# EAGLE design HID2AMI.Deluxe.Rev2.0.0 (EAGLE 9.6.2)
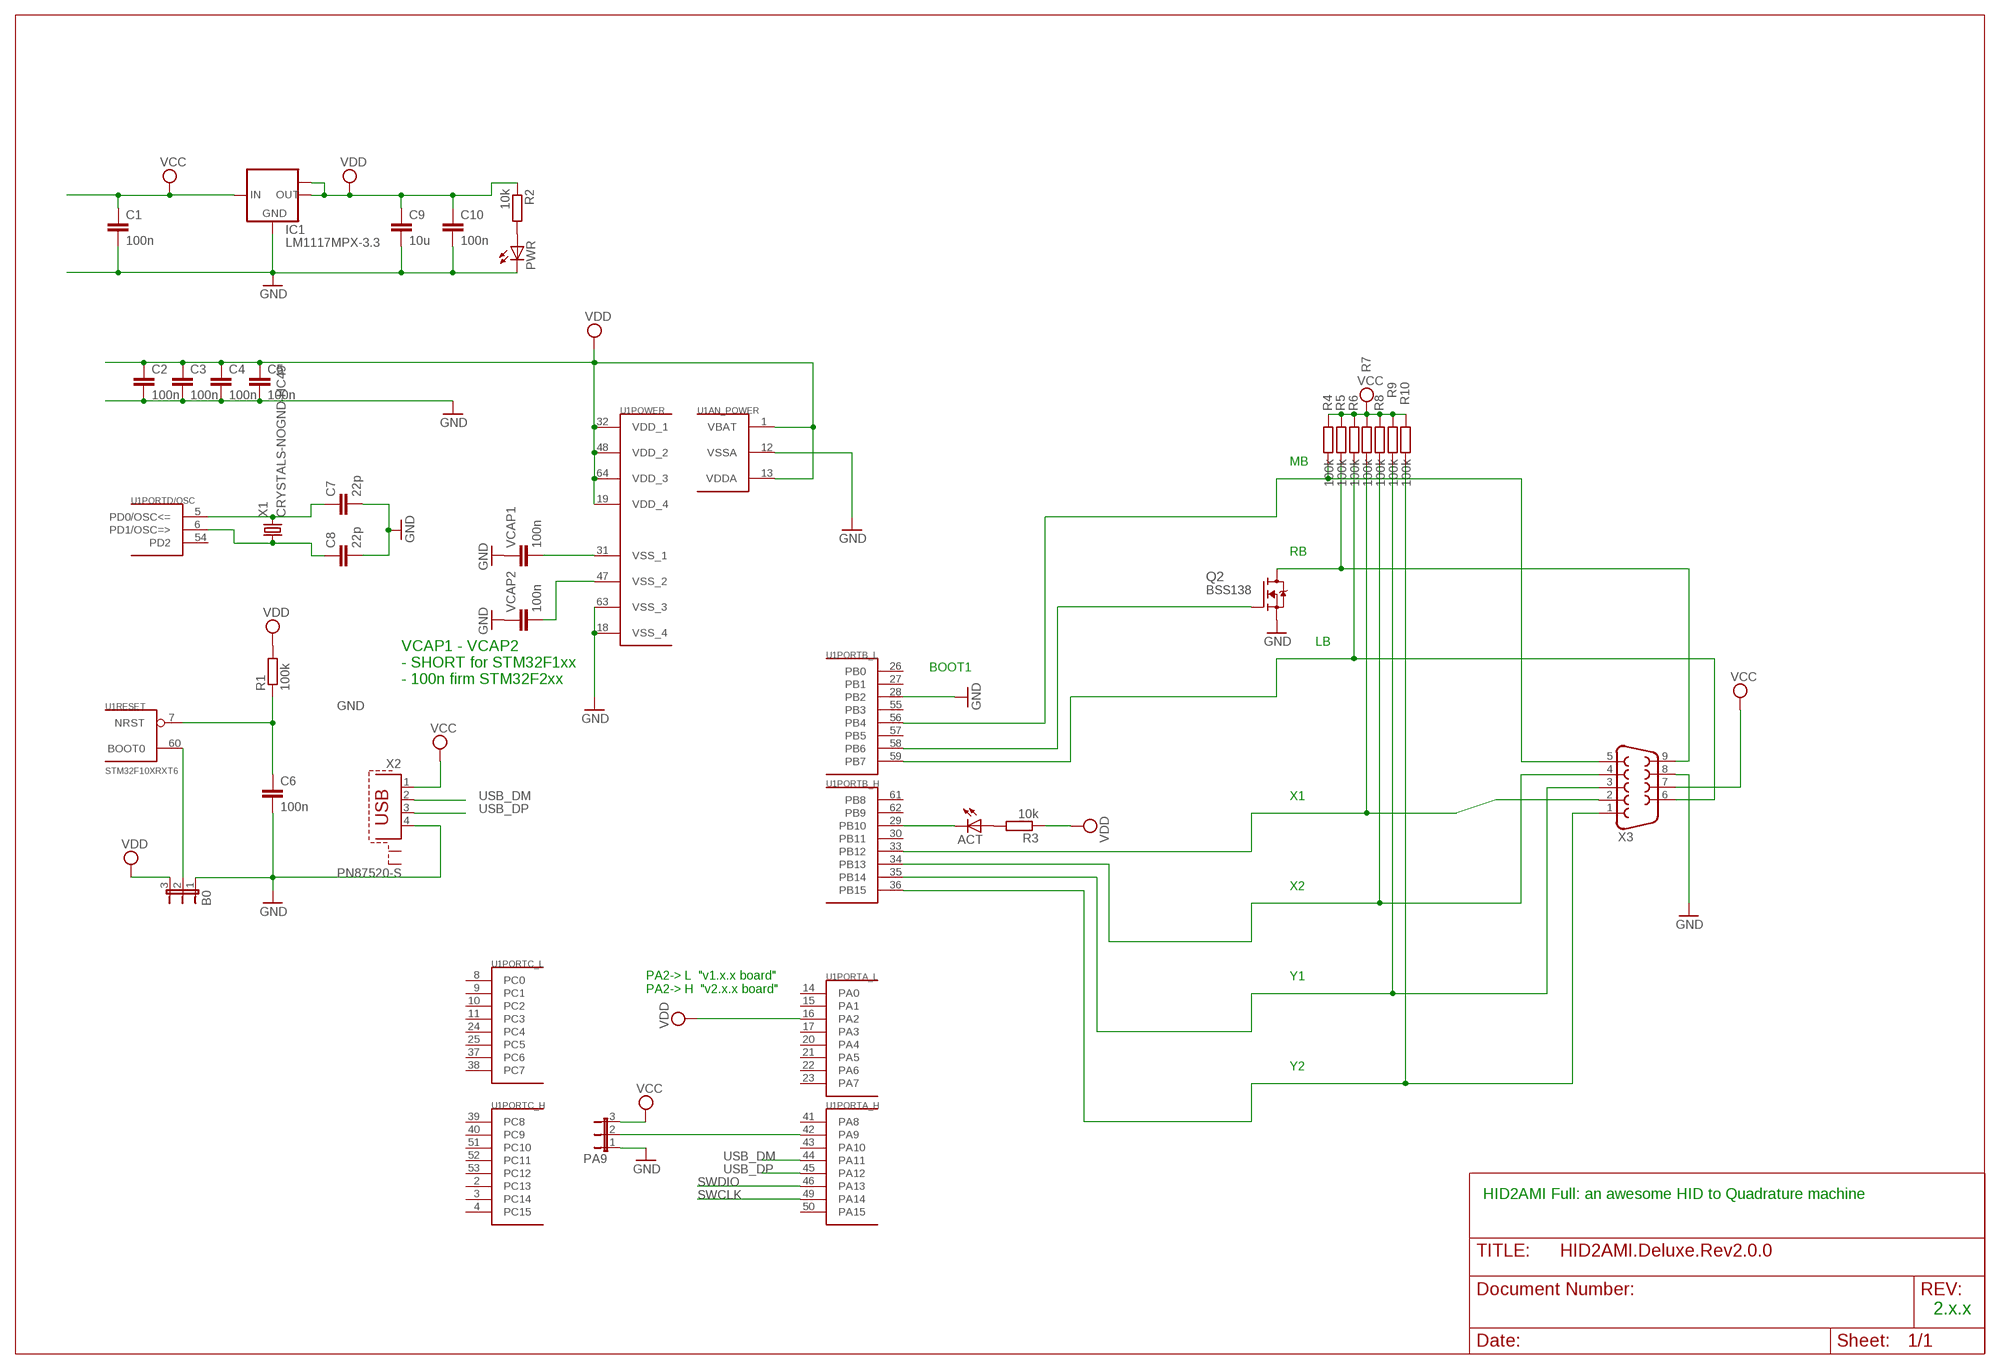
[diagram p0: schematic, sheet 1]

## Parts
ACT  LEDSML0805  [SML0805]
B0  JP2E  [JP2]
C1  100n  C-EUC0805  [C0805]
C2  100n  C-EUC0805  [C0805]
C3  100n  C-EUC0805  [C0805]
C4  100n  C-EUC0805  [C0805]
C5  100n  C-EUC0805  [C0805]
C6  100n  C-EUC0805  [C0805]
C7  22p  C-EUC0805  [C0805]
C8  22p  C-EUC0805  [C0805]
C9  10u  C-EUC0805  [C0805]
C10  100n  C-EUC0805  [C0805]
IC1  LM1117MPX-3.3  [SOT223]
PA9  JP2E  [JP2]
PWR  LEDSML0805  [SML0805]
Q2  BSS138  [SOT23]
R1  100k  R-EU_M0805  [M0805]
R2  10k  R-EU_M0805  [M0805]
R3  10k  R-EU_M0805  [M0805]
R4  100k  R-EU_M0805  [M0805]
R5  100k  R-EU_M0805  [M0805]
R6  100k  R-EU_M0805  [M0805]
R7  100k  R-EU_M0805  [M0805]
R8  100k  R-EU_M0805  [M0805]
R9  100k  R-EU_M0805  [M0805]
R10  100k  R-EU_M0805  [M0805]
U1  STM32F10XRXT6  [TQFP64]
VCAP1  100n  C-EUC0805  [C0805]
VCAP2  100n  C-EUC0805  [C0805]
X1  CRYSTALS-NOGND-HC49  [HC49]
X2  PN87520-S  [PN87520-S]
X3  F09HP  [F09HP]

## Nets
ACT: R7.2 U1.33(PORTB_H:PB12) X3.2
GND: B0.1 C1.2 C2.2 C3.2 C4.2 C5.2 C6.2 C7.2 C8.2 C9.2 C10.2 IC1.1(GND) PA9.1 PWR.C Q2.2(S) U1.12(AN_POWER:VSSA) U1.18(POWER:VSS_4) U1.28(PORTB_L:PB2) U1.63(POWER:VSS_3) VCAP1.1 VCAP2.1 X2.4 X3.8
N$1: C7.1 U1.5(PORTD/OSC:PD0/OSC<=) X1.2
N$2: C8.1 U1.6(PORTD/OSC:PD1/OSC=>) X1.1
N$3: B0.2 U1.60(RESET:BOOT0)
N$4: U1.31(POWER:VSS_1) VCAP1.2
N$5: PA9.2 U1.42(PORTA_H:PA9)
N$6: U1.47(POWER:VSS_2) VCAP2.2
N$7: ACT.A R3.2
N$8: ACT.C U1.29(PORTB_H:PB10)
N$12: PWR.A R2.2
N$13: R4.2 U1.56(PORTB_L:PB4) X3.5
N$14: Q2.1(G) U1.58(PORTB_L:PB6)
N$15: R6.2 U1.59(PORTB_L:PB7) X3.6
N$35: Q2.3(D) R5.2 X3.9
N$38: R8.2 U1.34(PORTB_H:PB13) X3.4
N$39: R9.2 U1.35(PORTB_H:PB14) X3.3
N$40: R10.2 U1.36(PORTB_H:PB15) X3.1
NRST: C6.1 R1.1 U1.7(RESET:NRST)
SWCLK: U1.49(PORTA_H:PA14)
SWDIO: U1.46(PORTA_H:PA13)
USB_DM: U1.44(PORTA_H:PA11) X2.2
USB_DP: U1.45(PORTA_H:PA12) X2.3
VCC: C1.1 IC1.3(IN) PA9.3 R4.1 R5.1 R6.1 R7.1 R8.1 R9.1 R10.1 X2.1 X3.7
VDD: B0.3 C2.1 C3.1 C4.1 C5.1 C9.1 C10.1 IC1.2(OUT) IC1.TAB(OUT1) R1.2 R2.1 R3.1 U1.1(AN_POWER:VBAT) U1.13(AN_POWER:VDDA) U1.16(PORTA_L:PA2) U1.19(POWER:VDD_4) U1.32(POWER:VDD_1) U1.48(POWER:VDD_2) U1.64(POWER:VDD_3)
Unconnected: U1.2(PORTC_H:PC13) U1.3(PORTC_H:PC14) U1.4(PORTC_H:PC15) U1.8(PORTC_L:PC0) U1.9(PORTC_L:PC1) U1.10(PORTC_L:PC2) U1.11(PORTC_L:PC3) U1.14(PORTA_L:PA0) U1.15(PORTA_L:PA1) U1.17(PORTA_L:PA3) U1.20(PORTA_L:PA4) U1.21(PORTA_L:PA5) U1.22(PORTA_L:PA6) U1.23(PORTA_L:PA7) U1.24(PORTC_L:PC4) U1.25(PORTC_L:PC5) U1.26(PORTB_L:PB0) U1.27(PORTB_L:PB1) U1.30(PORTB_H:PB11) U1.37(PORTC_L:PC6) U1.38(PORTC_L:PC7) U1.39(PORTC_H:PC8) U1.40(PORTC_H:PC9) U1.41(PORTA_H:PA8) U1.43(PORTA_H:PA10) U1.50(PORTA_H:PA15) U1.51(PORTC_H:PC10) U1.52(PORTC_H:PC11) U1.53(PORTC_H:PC12) U1.54(PORTD/OSC:PD2) U1.55(PORTB_L:PB3) U1.57(PORTB_L:PB5) U1.61(PORTB_H:PB8) U1.62(PORTB_H:PB9) X2.S1 X2.S2

## Notes on the sheet
- MB
- RB
- LB
- BOOT1
- VCAP1 - VCAP2
  - SHORT for STM32F1xx
  - 100n firm STM32F2xx
- X1
- X2
- Y1
- PA2-> L  "v1.x.x board"
  PA2-> H  "v2.x.x board"
- Y2
- HID2AMI Full: an awesome HID to Quadrature machine
- 2.x.x

## Library data of the parts
ACT PWR = led:LED: LED OSRAM: - CHIPLED LG R971, LG N971, LY N971, LG Q971, LY Q971, LO R971, LY R971 LH N974, LH R974 LS Q976, LO Q976, LY Q976 LO Q996 - Hyper CHIPLED LW Q18S LB Q993, LB Q99A, LB R99A - SideLED LS A670, LO A670, LY A670, LG A670, LP A670 LB A673, LV A673, LT A673, LW A673 LH A674 LY A675 LS A676, LA A676, LO A676, LY A676, LW A676 LS A679, LY A679, LG A679 - Hyper Micro SIDELED® LS Y876, LA Y876, LO Y876, LY Y876 LT Y87S - SmartLED LW L88C, LW L88S LB L89C, LB L89S, LG L890 LS L89K, LO L89K, LY L89K LS L896, LA L896, LO L896, LY L896 - TOPLED LS T670, LO T670, LY T670, LG T670, LP T670 LSG T670, LSP T670, LSY T670, LOP T670, LYG T670 LG T671, LOG T671, LSG T671 LB T673, LV T673, LT T673, LW T673 LH T674 LS T676, LA T676, LO T676, LY T676, LB T676, LH T676, LSB T676, LW T676 LB T67C, LV T67C, LT T67C, LS T67K, LO T67K, LY T67K, LW E67C LS E67B, LA E67B, LO E67B, LY E67B, LB E67C, LV E67C, LT E67C LW T67C LS T679, LY T679, LG T679 LS T770, LO T770, LY T770, LG T770, LP T770 LB T773, LV T773, LT T773, LW T773 LH T774 LS E675, LA E675, LY E675, LS T675 LS T776, LA T776, LO T776, LY T776, LB T776 LHGB T686 LT T68C, LB T68C - Hyper Mini TOPLED® LB M676 - Mini TOPLED Santana® LG M470 LS M47K, LO M47K, LY M47K Source: http://www.osram.convergy.de LUXEON: - LUMILED® LXK2-PW12-R00, LXK2-PW12-S00, LXK2-PW14-U00, LXK2-PW14-V00 LXK2-PM12-R00, LXK2-PM12-S00, LXK2-PM14-U00 LXK2-PE12-Q00, LXK2-PE12-R00, LXK2-PE12-S00, LXK2-PE14-T00, LXK2-PE14-U00 LXK2-PB12-K00, LXK2-PB12-L00, LXK2-PB12-M00, LXK2-PB14-N00, LXK2-PB14-P00, LXK2-PB14-Q00 LXK2-PR12-L00, LXK2-PR12-M00, LXK2-PR14-Q00, LXK2-PR14-R00 LXK2-PD12-Q00, LXK2-PD12-R00, LXK2-PD12-S00 LXK2-PH12-R00, LXK2-PH12-S00 LXK2-PL12-P00, LXK2-PL12-Q00, LXK2-PL12-R00 Source: www.luxeon.com KINGBRIGHT: KA-3528ASYC Source: www.kingbright.com
B0 PA9 = jumper:JP2E: JUMPER
C1-C10 VCAP1 VCAP2 = rcl:C-EU: CAPACITOR, European symbol; SPICEPREFIX: C
IC1 = lm1117:LM1117MPX-*
Q2 = bss138_10:BSS138: BSS138 N-Channel Logic Level Enhancement Mode Field Effect Transistor Source: http://www.fairchildsemi.com/datasheets/BS/BSS138.pdf; MF: Fairchild; MPN: BSS138; OC_FARNELL: 9845330; OC_NEWARK: 67R2009
R1-R10 = rcl:R-EU_: RESISTOR, European symbol; SPICEPREFIX: R
U1 = stm32:STM32F10XRXT6: STM32F101/103 64pin LQFP
X1 = IQD-Frequency-Products:CRYSTALS-NOGND: CRYSTALS CAN NOT GROUNDED
X2 = con-berg:PN87520-S; OC_FARNELL: unknown; OC_NEWARK: unknown
X3 = con-subd:F09: SUB-D; OC_FARNELL: unknown; OC_NEWARK: unknown

## Board
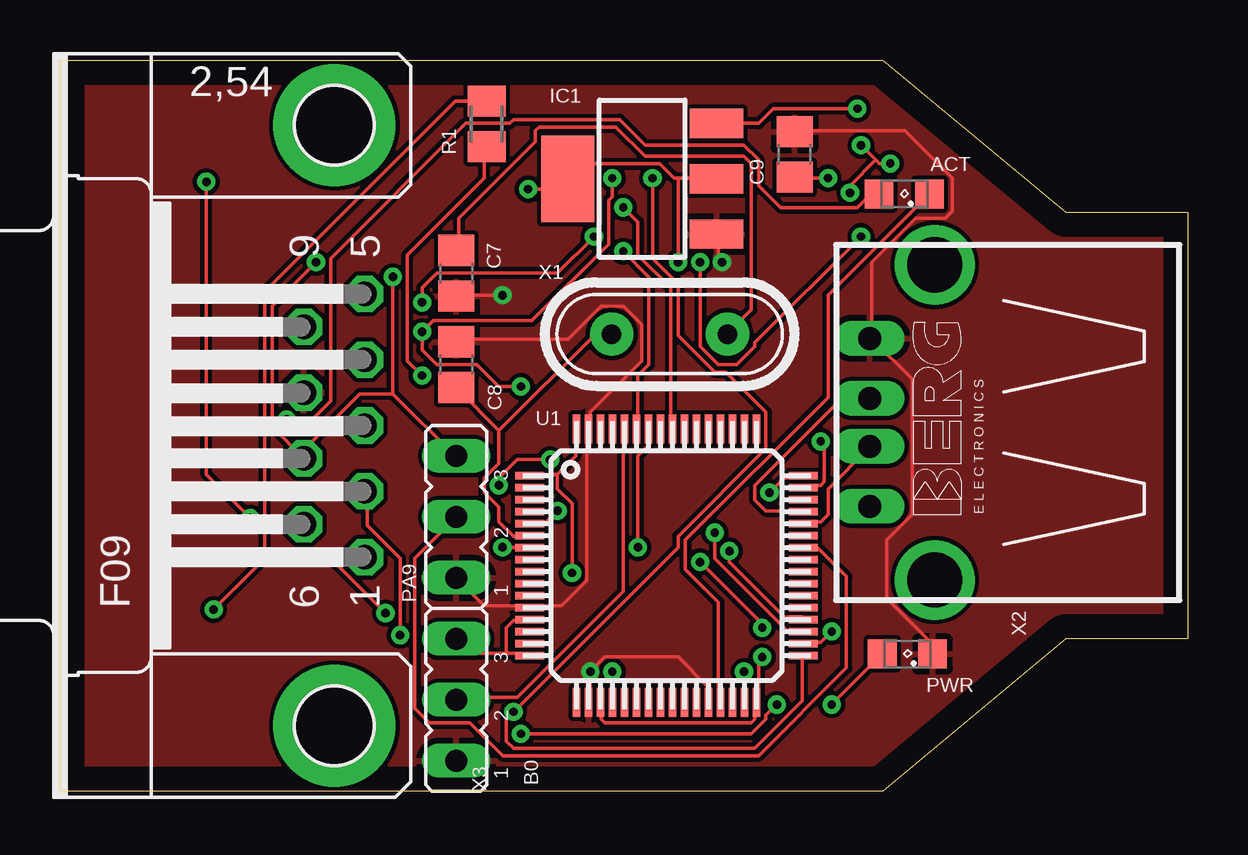
[diagram p1: board, top side]
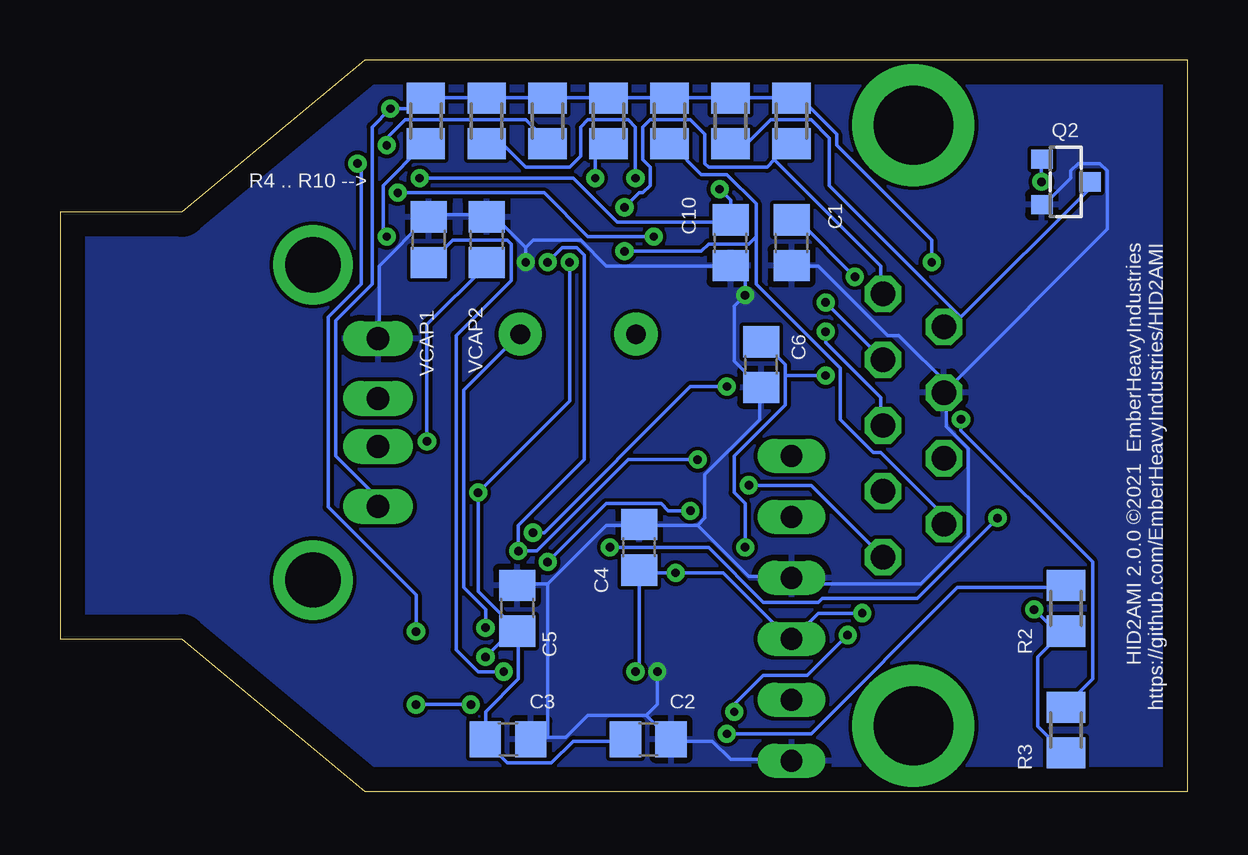
[diagram p2: board, bottom side, seen from below]

Size 46.99 x 30.48 mm. Coordinates in mm from the lower left corner, seen from the top.
Outline: 0,30.48 34.29,30.48 41.91,24.13 46.99,24.13 46.99,6.35 41.91,6.35 34.29,0 0,0 0,30.48
Copper layers (1*16): Top 0.035mm / dielectric 1.5mm / Bottom 0.035mm
Design rules "default *": minimum track width 6mil, minimum drill 0.35mm, track to track 6mil, track to pad 6mil, pad to pad 6mil, via to via 6mil, smd to smd 6mil, copper to edge 40mil, drill to drill 6mil, minimum pad ring 10mil, minimum via ring 8mil, stop-mask expansion 4mil, vias tented up to drill 0mil, thermal gap 10mil

### Footprints (pad centres in the part's own frame; a part is rotated, then mirrored left to right if it is on the bottom)
SML0805 = smd 1.2 x 1.2: A 1.05,0; C -1.05,0
JP2 = drill 0.914 long: 1 -2.54,0; 2 0,0; 3 2.54,0
C0805 = smd 1.3 x 1.5: 1 -0.95,0; 2 0.95,0
SOT223 = smd 1.219 x 2.235: 1 -2.311,-3.099; 2 0,-3.099; 3 2.311,-3.099 | smd 3.6 x 2.2: TAB 0,3.099
SOT23 = smd 0.8 x 0.9: 1 -0.95,-1; 2 0.95,-1; 3 0,1
M0805 = smd 1.3 x 1.6: 1 -0.95,0; 2 0.95,0
TQFP64 = smd 1.2 x 0.3: 1 -5.7,3.75; 2 -5.7,3.25; 3 -5.7,2.75; 4 -5.7,2.25; 5 -5.7,1.75; 6 -5.7,1.25; 7 -5.7,0.75; 8 -5.7,0.25; 9 -5.7,-0.25; 10 -5.7,-0.75; 11 -5.7,-1.25; 12 -5.7,-1.75; 13 -5.7,-2.25; 14 -5.7,-2.75; 15 -5.7,-3.25; 16 -5.7,-3.75; 33 5.7,-3.75; 34 5.7,-3.25; 35 5.7,-2.75; 36 5.7,-2.25; 37 5.7,-1.75; 38 5.7,-1.25; 39 5.7,-0.75; 40 5.7,-0.25; 41 5.7,0.25; 42 5.7,0.75; 43 5.7,1.25; 44 5.7,1.75; 45 5.7,2.25; 46 5.7,2.75; 47 5.7,3.25; 48 5.7,3.75 | smd 0.3 x 1.2: 17 -3.75,-5.7; 18 -3.25,-5.7; 19 -2.75,-5.7; 20 -2.25,-5.7; 21 -1.75,-5.7; 22 -1.25,-5.7; 23 -0.75,-5.7; 24 -0.25,-5.7; 25 0.25,-5.7; 26 0.75,-5.7; 27 1.25,-5.7; 28 1.75,-5.7; 29 2.25,-5.7; 30 2.75,-5.7; 31 3.25,-5.7; 32 3.75,-5.7; 49 3.75,5.7; 50 3.25,5.7; 51 2.75,5.7; 52 2.25,5.7; 53 1.75,5.7; 54 1.25,5.7; 55 0.75,5.7; 56 0.25,5.7; 57 -0.25,5.7; 58 -0.75,5.7; 59 -1.25,5.7; 60 -1.75,5.7; 61 -2.25,5.7; 62 -2.75,5.7; 63 -3.25,5.7; 64 -3.75,5.7
HC49 = drill 0.813 pad 1.8: 1 -2.413,0; 2 2.413,0
PN87520-S = drill 0.95 long: 1 -3.5,2.71; 2 -1,2.71; 3 1,2.71; 4 3.5,2.71 | drill 2.3 pad 2.9: S1 -6.57,0; S2 6.57,0
F09HP = drill 1.016 octagon: 1 -5.486,-1.27; 2 -2.743,-1.27; 3 0,-1.27; 4 2.743,-1.27; 5 5.486,-1.27; 6 -4.115,1.27; 7 -1.372,1.27; 8 1.372,1.27; 9 4.115,1.27 | drill 3.302 pad 5.08: G1 -12.522,0; G2 12.522,0

### Placement (x,y rotation side)
ACT  35.18,24.89 180 top
B0  16.51,3.81 90 top
C1  16.51,22.86 270 bottom
C2  22.48,2.16 0 bottom
C3  28.32,2.16 0 bottom
C4  22.86,10.16 90 bottom
C5  27.94,7.62 90 bottom
C6  17.78,17.78 270 bottom
C7  16.51,21.59 270 top
C8  16.51,17.78 90 top
C9  30.61,26.54 90 top
C10  19.05,22.86 270 bottom
IC1  24.26,25.53 90 top
PA9  16.51,11.43 90 top
PWR  35.31,5.71 180 top
Q2  5.08,25.4 270 bottom
R1  17.78,27.81 90 top
R2  5.08,7.62 90 bottom
R3  5.08,2.54 90 bottom
R4  16.51,27.94 270 bottom
R5  19.05,27.94 270 bottom
R6  21.59,27.94 270 bottom
R7  24.13,27.94 270 bottom
R8  26.67,27.94 270 bottom
R9  29.21,27.94 270 bottom
R10  31.75,27.94 270 bottom
U1  25.27,9.4 0 top
VCAP1  31.62,22.99 270 bottom
VCAP2  29.21,22.99 270 bottom
X1  25.4,19.05 0 top
X2  36.45,15.37 90 top
X3  11.43,15.24 90 top

### Tracks (layer width: path | path; a pad name or v marks a point on that pad's centre or on a via)
ACT  (via drill 0.35)
  Top 0.152: v24.69,25.55 24.69,22.2 25.76,21.13 25.76,19 27.28,17.48 27.74,17.48 29.41,15.8 29.41,14.28 25.76,10.62 25.76,10.16 v18.9,3.3 18.59,3 18.59,2.08 18.9,1.78 28.96,1.78 30.94,3.76 30.94,5.59 U1.33 | v14.17,6.5 14.17,9.7 12.8,11.07 12.8,12.45 X3.2
  Bottom 0.152: v24.69,25.55 24.69,26.47 24.23,26.92 R7.2 | v14.17,6.5 15.85,4.83 17.68,4.83 18.9,3.61 v18.9,3.3
GND  (via drill 0.35)
  Top 0.152: v18.44,20.68 16.61,20.68 C7.2 | v27.58,22.05 27.43,22.2 27.43,23.11 IC1.1 | PWR.C 36.27,5.74 36.27,6.2 34.44,8.03 34.44,10.46 35.51,11.53 35.51,17.17 33.83,18.85 X2.4 33.83,19 33.83,22.05 35.66,23.88 36.88,23.88 37.19,24.18 37.19,25.55 35.2,27.53 30.63,27.53 C9.2 | PA9.1 17.68,7.72 19.51,7.72 U1.12 19.66,7.72 20.88,7.72 21.95,8.79 21.95,15.04 U1.63 22.1,15.19 22.1,15.8 24.23,17.93 24.23,19.46 23.47,20.22 22.55,20.22 21.18,18.85 16.61,18.85 C8.2 | U1.18 22.1,3.76 v22.1,4.98 22.71,5.59 25.76,5.59 26.98,4.37 26.98,3.76 U1.28
  Bottom 0.152: 19.05,21.89 18.44,21.29 v18.44,20.68 18.9,20.22 18.9,17.93 17.83,16.87 C6.2 17.83,16.71 17.83,15.49 20.12,13.21 20.12,11.38 20.42,11.07 | 27.58,22.66 v27.58,22.05 | 27.58,22.66 28.8,23.88 29.11,23.88 VCAP2.1 29.26,24.03 31.55,24.03 VCAP1.1 31.7,23.88 33.68,21.89 33.68,19 X2.4 | 19.05,21.89 24.23,21.89 25.3,22.96 27.28,22.96 27.58,22.66 | 19.05,21.89 C10.2 | X3.8 9.91,16.87 | 9.91,16.87 3.35,23.42 3.35,25.86 3.66,26.16 4.57,26.16 4.88,25.86 4.88,25.55 5.94,24.49 Q2.2 | 9.91,16.87 12.04,19 12.5,19 15.39,21.89 16.46,21.89 C1.2 | 10.06,16.71 X3.8 | 22.86,11.07 24.23,11.07 26.67,8.64 | 26.67,8.64 27.89,8.64 C5.2 | B0.1 16.61,1.32 19.05,1.32 19.81,2.08 21.49,2.08 C2.2 21.64,2.23 22.55,3.15 | 26.67,2.23 25.91,2.23 24.99,3.15 22.55,3.15 | 26.67,2.23 27.28,2.23 C3.2 | v22.1,4.98 22.1,3.61 22.55,3.15 | 26.67,2.23 26.67,8.64 | 20.42,11.07 18.29,8.94 16.61,8.94 PA9.1 16.46,8.79 16.31,8.64 11.12,8.64 9.14,10.62 9.14,14.28 10.06,15.19 10.06,16.56 X3.8 | 22.86,11.07 20.42,11.07 | 22.86,11.07 C4.2
  pour Bottom (isolate 0.127): 0,30.48 35.56,30.48 41.91,24.13 46.99,24.13 46.99,6.35 41.91,6.35 35.56,0 0,0
  pour Top (isolate 0.178): 0,30.48 35.56,30.48 41.91,24.13 46.99,24.13 46.99,6.35 41.91,6.35 35.56,0 0,0
N$1  (via drill 0.35)
  Top 0.152: v20.73,11.68 20.27,11.23 19.66,11.23 U1.5 | v26.67,9.55 29.26,6.96 v29.26,6.81 | C7.1 16.61,22.66 16.61,23.88 19.81,27.08 19.81,27.53 19.96,27.69 23.16,27.69 24.38,26.47 28.5,26.47 28.8,26.16 28.8,20.07 27.89,19.15 X1.2
  Bottom 0.152: v20.73,11.68 21.64,11.68 21.95,11.99 24.23,11.99 v26.67,9.55 | v29.26,6.81 29.26,7.57 30.18,8.48 30.18,16.71 27.89,19 X1.2
N$2
  Top 0.152: 18.29,15.04 18.29,13.67 17.68,13.06 17.68,12.45 18.29,11.84 18.29,11.23 18.9,10.62 19.51,10.62 U1.6 | 18.29,15.04 16.61,16.71 C8.1 | 18.29,15.04 22.25,19 22.86,19 X1.1
N$3
  Top 0.152: U1.60 23.47,15.04 23.47,8.33 19.05,3.91 16.61,3.91 B0.2
N$4  (via drill 0.35)
  Top 0.152: v28.5,4.98 28.5,3.76 U1.31
  Bottom 0.152: v28.5,4.98 29.57,4.98 30.48,5.89 30.48,19 28.19,21.29 28.19,22.81 28.35,22.96 30.63,22.96 31.55,22.05 VCAP1.2
N$5
  Top 0.152: PA9.2 14.78,9.7 14.78,3.45 15.39,2.85 17.07,2.85 18.44,1.47 29.11,1.47 32.77,5.13 32.77,8.94 31.55,10.16 31.09,10.16 U1.42
N$6  (via drill 0.35)
  Top 0.152: v31.7,14.58 31.85,14.43 31.85,12.9 31.7,12.75 31.09,12.75 U1.47
  Bottom 0.152: v31.7,14.58 31.7,19.46 29.26,21.89 VCAP2.2
N$7  (via drill 0.35)
  Top 0.152: v9.45,15.49 10.52,15.49 11.28,16.26 11.28,22.2 16.92,27.84 18.75,27.84 18.9,27.99 23.32,27.99 24.38,26.92 28.5,26.92 29.11,26.31 29.11,25.25 30.02,24.33 33.22,24.33 33.68,24.79 33.98,24.79 ACT.A
  Bottom 0.152: v9.45,15.49 9.45,15.04 3.96,9.55 3.96,4.67 5.03,3.61 R3.2
N$8
  Top 0.152: U1.29 27.43,3.76 27.43,7.87 26.06,9.25 26.06,10.46 32,16.41 32,20.68 36.12,24.79 ACT.C
N$12  (via drill 0.35)
  Top 0.152: v32.16,3.61 34.14,5.59 PWR.A | v29.87,3.61 29.41,3.15 29.41,3 28.8,2.39 v19.2,2.39
  Bottom 0.152: v29.87,3.61 v32.16,3.61 | v19.2,2.39 15.7,2.39 9.6,8.48 5.18,8.48 R2.2
N$13  (via drill 0.35)
  Top 0.152: v23.47,24.33 24.08,23.72 24.08,22.35 25.45,20.98 25.45,15.19 U1.56
  Bottom 0.152: v23.47,24.33 22.86,24.94 22.71,24.94 22.4,25.25 22.4,26.01 22.71,26.31 22.71,27.69 22.4,27.99 20.73,27.99 20.12,27.38 20.12,26.16 19.96,26.01 17.53,26.01 17.22,26.31 | 17.22,26.31 16.61,26.92 R4.2 | 17.22,26.31 12.8,21.89 12.8,20.83 X3.5
N$14  (via drill 0.35)
  Top 0.152: v6.1,25.4 6.1,13.21 v7.92,11.38 | v24.08,10.16 24.08,13.97 24.54,14.43 24.54,15.04 U1.58
  Bottom 0.152: v6.1,25.4 6.1,26.31 Q2.1 | v7.92,11.38 11.28,8.03 15.24,8.03 15.39,7.87 17.68,7.87 19.96,10.16 v24.08,10.16
N$15  (via drill 0.35)
  Top 0.152: v23.47,22.5 24.54,21.44 24.54,17.78 24.08,17.32 24.08,15.19 U1.59
  Bottom 0.152: v23.47,22.5 20.27,22.5 19.96,22.81 18.29,22.81 17.98,23.11 | 17.98,23.11 17.98,24.49 19.2,25.71 20.27,25.71 21.49,26.92 R6.2 | 17.98,23.11 17.98,21.13 14.48,17.63 14.48,15.49 13.11,14.12 12.8,14.12 10.21,11.53 10.21,11.23 X3.6
N$35
  Bottom 0.152: 9.45,19.76 9.75,19.46 10.06,19.46 X3.9 | 9.45,19.76 4.12,25.09 4.12,25.4 Q2.3 | 9.45,19.76 14.94,25.25 14.94,27.23 15.7,27.99 17.37,27.99 18.29,27.08 19.05,27.08 R5.2
N$38  (via drill 0.35)
  Top 0.152: v32.16,6.65 31.7,6.2 31.09,6.2 U1.34 | v34.59,26.16 34.14,26.16 33.98,26.31 | v33.38,26.92 33.98,26.31 | v15.09,20.37 15.09,20.98 15.7,21.59 20.73,21.59 v22.25,23.11 | v32.92,24.94 32.92,25.25 33.98,26.31
  Bottom 0.152: v32.16,6.65 32.16,8.18 35.81,11.84 35.81,19.76 34.44,21.13 34.44,26.01 v34.59,26.16 | v33.38,26.92 33.38,27.23 32.61,27.99 27.58,27.99 26.67,27.08 R8.2 | v15.09,20.37 X3.4 | v22.25,23.11 24.99,23.11 26.82,24.94 v32.92,24.94
N$39  (via drill 0.35)
  Top 0.152: v27.28,10.77 27.28,9.7 30.33,6.65 30.94,6.65 U1.35 | v19.2,16.87 18.29,16.87 17.37,17.78 15.7,17.78 15.09,18.39 v15.09,19.15 15.54,19.61 19.66,19.61 22.86,22.81 22.86,24.64 23.01,24.79 v23.01,25.55
  Bottom 0.152: v27.28,10.77 26.82,10.77 20.73,16.87 v19.2,16.87 | v15.09,19.15 15.09,18.69 12.8,16.41 12.8,15.34 X3.3 | v23.01,25.55 23.01,27.69 23.32,27.99 24.99,27.99 25.3,27.69 25.3,26.47 25.76,26.01 27.58,26.01 28.5,26.92 29.11,26.92 R9.2
N$40  (via drill 0.35)
  Top 0.152: v27.89,10.01 27.89,9.55 30.18,7.26 30.94,7.26 U1.36 | v20.42,13.82 19.05,13.82 18.29,13.06 v18.29,12.75 | v33.38,23.11 28.96,18.69 28.96,18.54 28.19,17.78 27.43,17.78 26.67,18.54 v26.67,22.05
  Bottom 0.152: v20.42,13.82 23.32,13.82 27.13,10.01 v27.89,10.01 27.89,11.07 25.15,13.82 25.15,22.35 25.45,22.66 26.06,22.66 v26.67,22.05 | v18.29,12.75 15.7,12.75 X3.1 | v33.38,23.11 33.53,23.27 33.53,25.25 31.85,26.92 R10.2
NRST  (via drill 0.35)
  Top 0.152: v18.44,10.16 19.51,10.16 U1.7 | v15.09,17.32 14.48,17.93 14.48,22.35 17.68,25.55 17.68,26.77 R1.1
  Bottom 0.152: v18.44,10.16 18.44,11.99 18.9,12.45 18.9,13.97 16.76,16.1 16.76,17.32 | 16.76,17.32 16.76,17.78 17.68,18.69 C6.1 | 16.76,17.32 v15.09,17.32
USB_DM
  Top 0.152: U1.44 31.09,11.23 31.7,11.23 32,11.53 32,12.6 33.68,14.28 X2.2
USB_DP
  Top 0.152: U1.45 30.94,11.68 29.41,11.68 28.96,12.14 28.96,12.75 32.46,16.26 33.68,16.26 X2.3
VCC  (via drill 0.35)
  Top 0.152: 13.87,16.56 v13.87,21.44 | 13.87,16.56 16.46,13.97 PA9.3 | 13.87,16.56 12.5,16.56 10.21,14.28 10.21,13.97 X3.7 8.84,15.19 8.84,20.22 v10.67,22.05 | v33.22,28.45 29.72,28.45 29.11,27.84 27.43,27.84 IC1.3
  Bottom 0.152: v13.87,21.44 16.15,23.72 16.46,23.72 C1.1 | 19.05,28.91 16.61,28.91 R4.1 16.46,28.75 16,28.75 14.63,27.38 14.63,26.92 10.67,22.96 v10.67,22.05 | 26.67,28.91 24.23,28.91 R7.1 24.08,28.91 21.64,28.91 R6.1 21.49,28.91 19.05,28.91 | 19.05,28.91 R5.1 | X2.1 33.83,11.99 33.83,12.29 35.51,13.97 35.51,19.61 33.98,21.13 33.98,27.69 v33.22,28.45 32.16,28.45 31.85,28.75 R10.1 31.7,28.91 29.26,28.91 R9.1 29.11,28.91 26.67,28.91 | 26.67,28.91 R8.1
VDD  (via drill 0.35)
  Top 0.152: 8.53,9.7 8.53,20.83 16.46,28.75 17.68,28.75 R1.2 | v6.4,7.57 8.53,9.7 | 20.73,13.21 19.66,13.21 U1.1 | 20.73,13.21 21.49,13.97 21.49,15.04 U1.64 | 18.59,5.74 17.22,5.74 16.61,6.35 B0.3 | 18.59,5.74 19.51,5.74 U1.16 | 18.59,5.74 18.59,6.81 18.9,7.11 19.51,7.11 U1.13 | 20.73,13.21 20.73,12.6 21.34,11.99 v21.34,9.09 | v19.51,25.09 20.73,25.09 21.03,25.4 IC1.TAB 21.18,25.55 21.79,26.16 24.99,26.16 25.6,25.55 25.76,25.55 | v32,25.55 30.63,25.55 C9.1 | 25.76,25.55 27.28,25.55 IC1.2 | v29.57,12.45 30.18,13.06 30.94,13.06 U1.48 | v29.26,5.59 29.11,5.44 29.11,3.76 U1.32 28.96,3.61 28.96,3 28.8,2.85 22.71,2.85 22.55,3 22.55,3.61 U1.19 22.55,3.76 22.55,4.52 v23.01,4.98 | v25.76,22.05 25.76,25.55 | 8.53,9.7 11.28,9.7 v13.56,7.42
  Bottom 0.152: 5.33,6.5 5.18,6.65 R2.1 5.33,6.5 | 5.33,6.5 6.25,5.59 6.25,2.69 5.18,1.63 R3.1 | 5.33,6.5 v6.4,7.57 | 22.86,9.09 v21.34,9.09 19.36,9.09 16.61,6.35 B0.3 16.46,6.35 15.39,7.42 v13.56,7.42 | v19.51,25.09 19.05,24.64 C10.1 19.05,23.72 23.77,23.72 25.6,25.55 v32,25.55 | C2.1 23.47,2.08 25.6,2.08 26.52,1.17 28.35,1.17 29.26,2.08 C3.1 29.26,2.23 29.26,3.3 27.89,4.67 27.89,6.65 C5.1 28.04,6.81 | 28.04,6.81 29.57,8.33 v29.57,12.45 25.76,16.26 v25.76,22.05 | 28.04,6.81 v29.26,5.59 | 22.86,9.09 22.86,5.13 v23.01,4.98 | 22.86,9.09 C4.1

### Text on the board
bPlace: R4 .. R10 --> | HID2AMI 2.0.0 ©2021 EmberHeavyIndustries / https://github.com/EmberHeavyIndustries/HID2AMI